# Altium schematic sheet Project_Information.SchDoc: =project_title
size Tabloid; CompanyName: Luxonis Holding; Organization: Luxonis Holding; Address1: 1925 Harmony Park Drive; Address2: Westminster, CO; Address3: 80234; Address4: United States; SheetNumber: 1; SheetTotal: 12
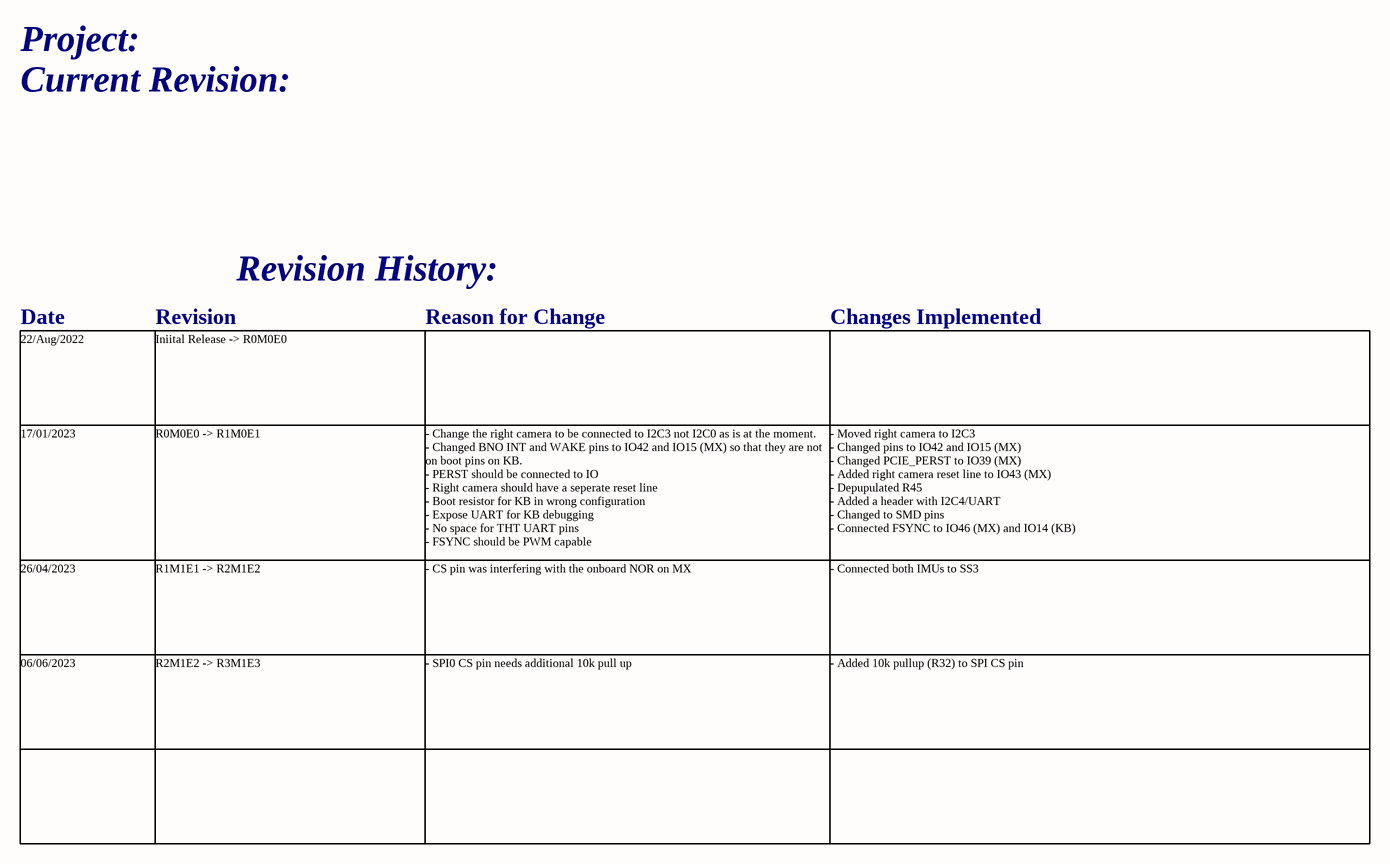
[diagram p0: Project_Information.SchDoc]

## Notes on the sheet
- Project:
- Current Revision:
- Revision History:
- Date
- Revision
- Reason for Change
- Changes Implemented
- 22/Aug/2022
- Iniital Release -> R0M0E0
- 17/01/2023
- R0M0E0 -> R1M0E1
- - Change the right camera to be connected to I2C3 not I2C0 as is at the moment.
  - Changed BNO INT and WAKE pins to IO42 and IO15 (MX) so that they are not on boot pins on KB.
  - PERST should be connected to IO
  - Right camera should have a seperate reset line
  - Boot resistor for KB in wrong configuration
  - Expose UART for KB debugging
  - No space for THT UART pins
  - FSYNC should be PWM capable
- - Moved right camera to I2C3
  - Changed pins to IO42 and IO15 (MX)
  - Changed PCIE_PERST to IO39 (MX)
  - Added right camera reset line to IO43 (MX)
  - Depupulated R45
  - Added a header with I2C4/UART
  - Changed to SMD pins
  - Connected FSYNC to IO46 (MX) and IO14 (KB)
- 26/04/2023
- R1M1E1 -> R2M1E2
- - CS pin was interfering with the onboard NOR on MX
- - Connected both IMUs to SS3
- 06/06/2023
- R2M1E2 -> R3M1E3
- - SPI0 CS pin needs additional 10k pull up
- - Added 10k pullup (R32) to SPI CS pin
- Title
- Size:
- Date:
- Tabloid
- Number:
- Time:
- Revision:
- Sheet
- of
- Drawn by: